# EAGLE schematic level (EAGLE 9.6.2)
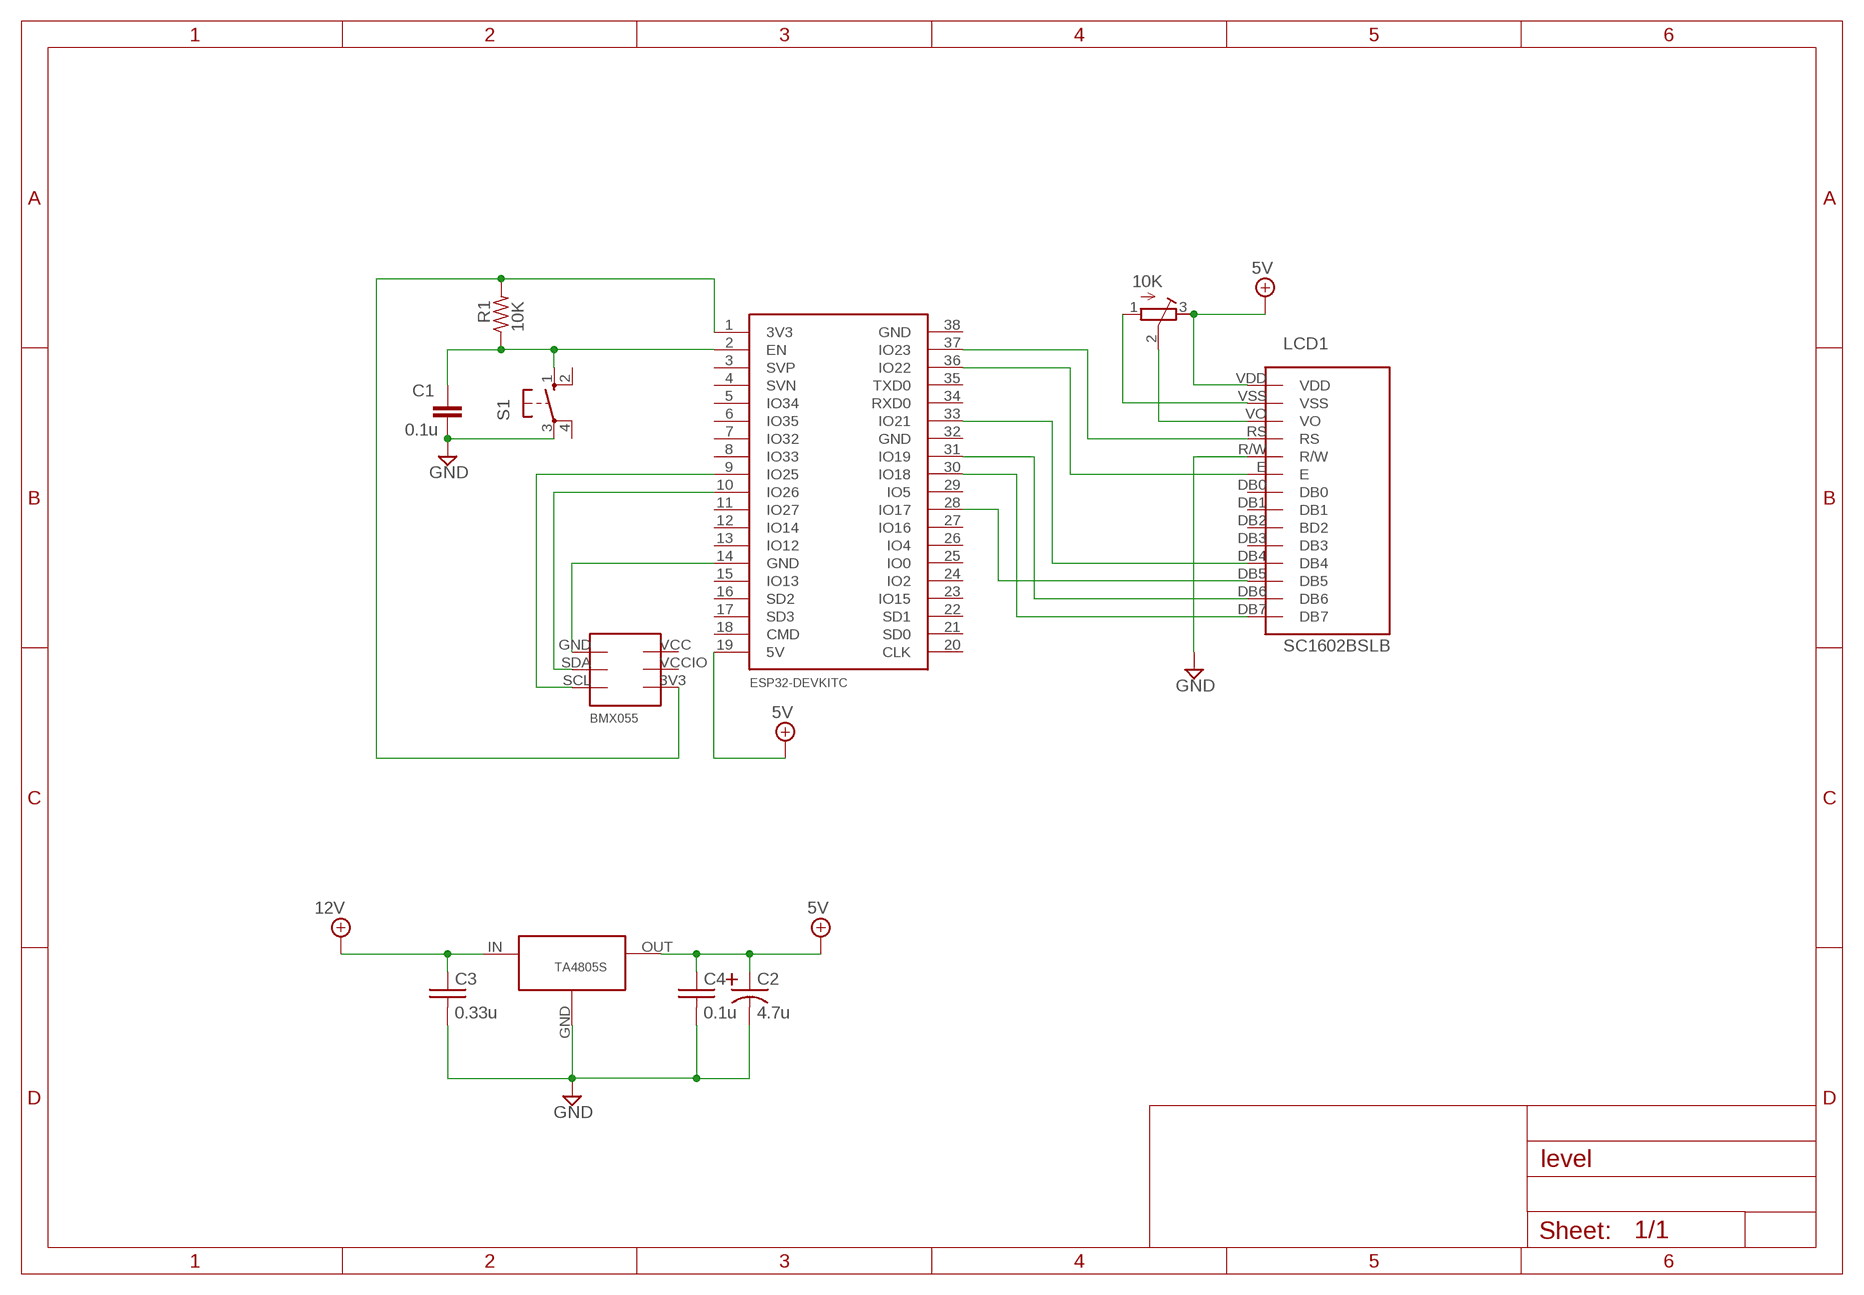
[diagram p0: schematic, sheet 1]

## Parts
C1  0.1u  CAPACITOR  [XC10B5]
C2  4.7u  ELECTROLYTICLAYDWN  [ELECTROLYTIC-LAYDWN]
C3  0.33u  CAPACITOR  [XC10B5]
C4  0.1u  CAPACITOR  [XC10B5]
LCD1  SC1602BSLB  [SC1602BSLB]
R1  10K  R-US_0204/7  [0204/7]
S1  SWITCH  [B3F-10XX]
TA4805S  REGULATOR  [REGULATOR]
U$1  ESP32DEVKITC  [ESP32-DEVKITC]
U$3  BMX055  [BMX055]
VR1  10K  VR  [VR]

## Nets
+5V/2: C3.2(P) TA4805S.IN ; supply symbol labelled 12V
+8V: C2.P C4.2(P) LCD1.VDD TA4805S.OUT U$1.19(5V) VR1.3(E) ; supply symbol labelled 5V
AGND: C1.2 C2.N C3.1(N) C4.1(N) LCD1.R/W S1.3(P) TA4805S.GND ; supply symbol labelled GND
N$1: LCD1.RS U$1.37(IO23)
N$2: LCD1.E U$1.36(IO22)
N$3: LCD1.DB4 U$1.33(IO21)
N$4: LCD1.DB6 U$1.31(IO19)
N$5: LCD1.DB7 U$1.30(IO18)
N$6: R1.2 U$1.1(3V3) U$3.3V3
N$7: C1.1 R1.1 S1.1(S) U$1.2(EN)
N$8: U$1.14(GND) U$3.GND
N$9: U$1.10(IO26) U$3.SDA
N$10: U$1.9(IO25) U$3.SCL
N$12: LCD1.DB5 U$1.28(IO17)
N$13: LCD1.VSS VR1.1(A)
N$14: LCD1.VO VR1.2(S)
Unconnected: LCD1.DB0 LCD1.DB1 LCD1.DB2(BD2) LCD1.DB3 S1.2(S1) S1.4(P1) U$1.3(SVP) U$1.4(SVN) U$1.5(IO34) U$1.6(IO35) U$1.7(IO32) U$1.8(IO33) U$1.11(IO27) U$1.12(IO14) U$1.13(IO12) U$1.15(IO13) U$1.16(SD2) U$1.17(SD3) U$1.18(CMD) U$1.20(CLK) U$1.21(SD0) U$1.22(SD1) U$1.23(IO15) U$1.24(IO2) U$1.25(IO0) U$1.26(IO4) U$1.27(IO16) U$1.29(IO5) U$1.32(GND) U$1.34(RXD0) U$1.35(TXD0) U$1.38(GND) U$3.VCC U$3.VCCIO

## Library data of the parts
C1 = 0000:CAPACITOR: X CAPACITOR for power line; SPICEPREFIX: C
C2 = Capacitor:ELECTROLYTIC
C3 C4 = Capacitor:CAPACITOR: X CAPACITOR for power line; SPICEPREFIX: C
LCD1 = LCD:SC1602BSLB: SC1602BSLB
R1 = 0000:R-US_: RESISTOR, American symbol; SPICEPREFIX: R
S1 = 0000:SWITCH: OMRON SWITCH; MPN: B3F-1000; OC_FARNELL: 176432; OC_NEWARK: 36M3542
TA4805S = Regulator:REGULATOR
U$1 = ESP32-DEVKITC:ESP32DEVKITC
U$3 = BMX055:BMX055
VR1 = Resister:VR